# EAGLE design SparkFun_LilyPad_Tricolor-LED (EAGLE 9.1.0)
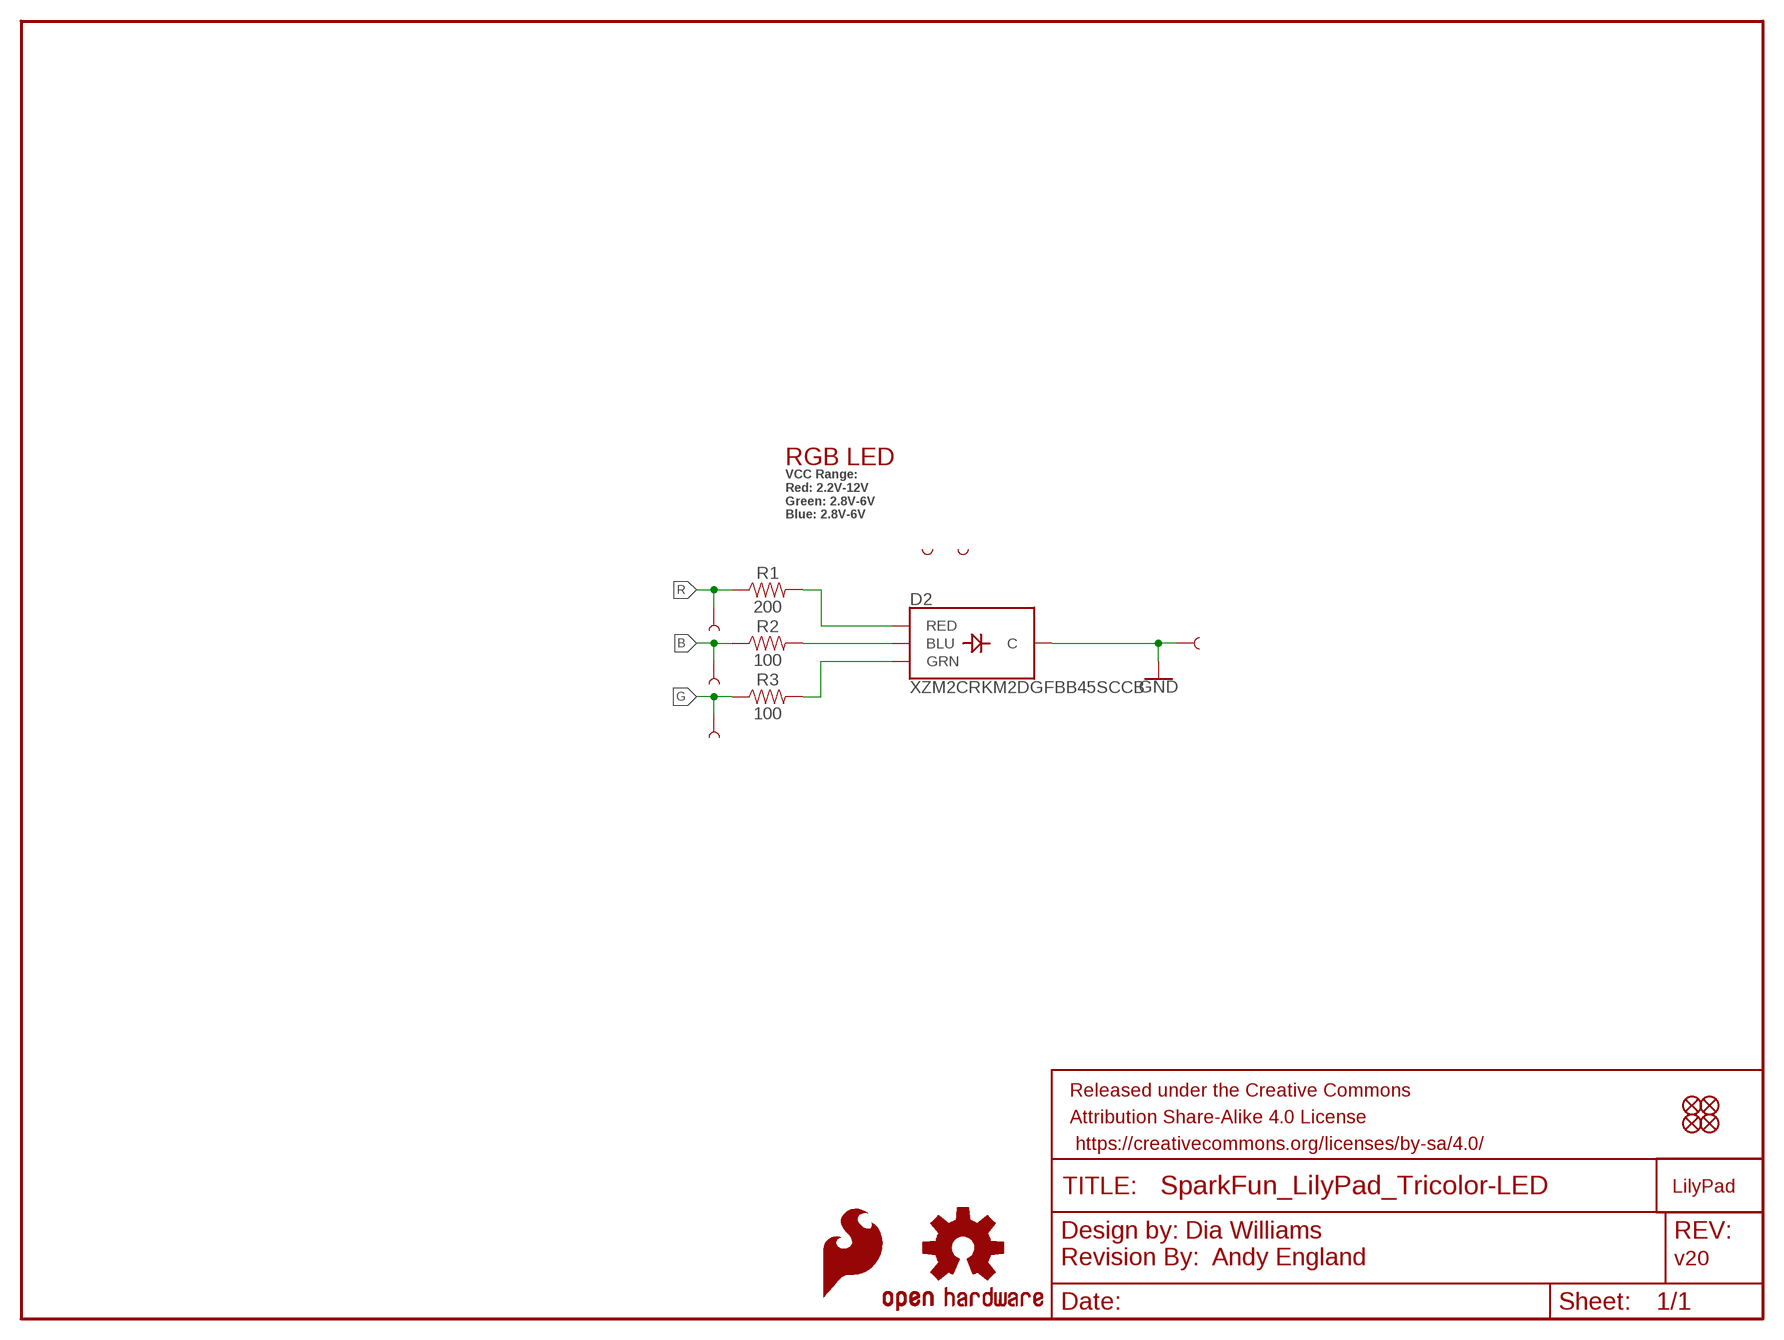
[diagram p0: schematic, sheet 1]

## Parts
D2  XZM2CRKM2DGFBB45SCCB  SUNLEDSMD1  [PLCC4SMDLED]
FD1  FIDUCIAL1X2  [FIDUCIAL-1X2]
FD2  FIDUCIAL1X2  [FIDUCIAL-1X2]
FD3  FIDUCIAL1X2  [FIDUCIAL-1X2]
FD4  FIDUCIAL1X2  [FIDUCIAL-1X2]
FRAME1  FRAME-LETTER  [CREATIVE_COMMONS]
LOGO1  REVISION  [REVISION]
LOGO2  OSHW-LOGOS  [OSHW-LOGO-S]
LOGO3  SFE_LOGO_FLAME.1_INCH  [SFE_LOGO_FLAME_.1]
R1  200  200OHM-0603-1/10W-1%  [0603]
R2  100  100OHM-0603-1/10W-1%  [0603]
R3  100  100OHM-0603-1/10W-1%  [0603]
U$1  LOGO-LPLP  [LOGO-LILYPAD]
U$2  SEWTAP-NOHOLE2  [PETAL-NOHOLE-2SIDE]
U$3  SEWTAP-NOHOLE2  [PETAL-NOHOLE-2SIDE]
U$7  SEWTAP6  [PETAL-SMALL-2SIDE]
U$8  SEWTAP6  [PETAL-SMALL-2SIDE]
U$9  SEWTAP6  [PETAL-SMALL-2SIDE]
U$10  SEWTAP6  [PETAL-SMALL-2SIDE]

## Nets
B: R2.1 U$9.1
BLU: D2.3(BLU) R2.2
G: R3.1 U$8.1
GND: D2.4(C) U$10.1
GRN: D2.2(GRN) R3.2
R: R1.1 U$7.1
RED: D2.1(RED) R1.2

## Notes on the sheet
- RGB LED
- VCC Range:
  Red: 2.2V-12V
  Green: 2.8V-6V
  Blue: 2.8V-6V
- Dia Williams
- Andy England | v20

## Library data of the parts
D2 = SparkFun-LED:SUNLED: LED-RGB Common Cathode XZM2CRKM2DGFBB45SCCB Packages: PLCC4 SparkFun Products: Lilypad Prototyping Board <[https://www.sparkfun.com/products/9264]>; PROD_ID: DIO-13722
FD1-FD4 = SparkFun-Aesthetics:FIDUCIAL: Fiducial Alignment Points Point-of-reference for pick-and-place machines and other optical instruments.
FRAME1 = SparkFun-Aesthetics:FRAME-LETTER: Schematic Frame - Letter Standard 8.5x11 US Letter frame
LOGO1 = SparkFun-Aesthetics:REVISION: "Revision By" Text Preceding text for revisor documentation. Includes schematic text on "symbols" layer, and board text on tDoc.
LOGO2 = SparkFun-Aesthetics:OSHW-LOGO: Open-Source Hardware (OSHW) Logo This logo indicates the piece of hardware it is found on incorporates a OSHW license and/or adheres to the definition of open source hardware found here: http://freedomdefined.org/OSHW
LOGO3 = SparkFun-Aesthetics:SFE_LOGO_FLAME: SparkFun Flame Logo This is the SparkFun flame logo. The logo on the schematic will always be the same size; the package variant is the height of the flame. Default layer for the logo on the board is tSilk.
R1 = SparkFun-Resistors:200OHM: 200Ω resistor A resistor is a passive two-terminal electrical component that implements electrical resistance as a circuit element. Resistors act to reduce current flow, and, at the same time, act to lower voltage levels within circuits. - Wikipedia; PROD_ID: RES-08220
R2 R3 = SparkFun-Resistors:100OHM: 100Ω resistor A resistor is a passive two-terminal electrical component that implements electrical resistance as a circuit element. Resistors act to reduce current flow, and, at the same time, act to lower voltage levels within circuits. - Wikipedia; PROD_ID: RES-07863
U$1 = SparkFun-Retired:LOGO-LP
U$2 U$3 = LilyPad-Wearables:SEWTAP-NOHOLE
U$7-U$10 = LilyPad-Wearables:SEWTAP

## Board
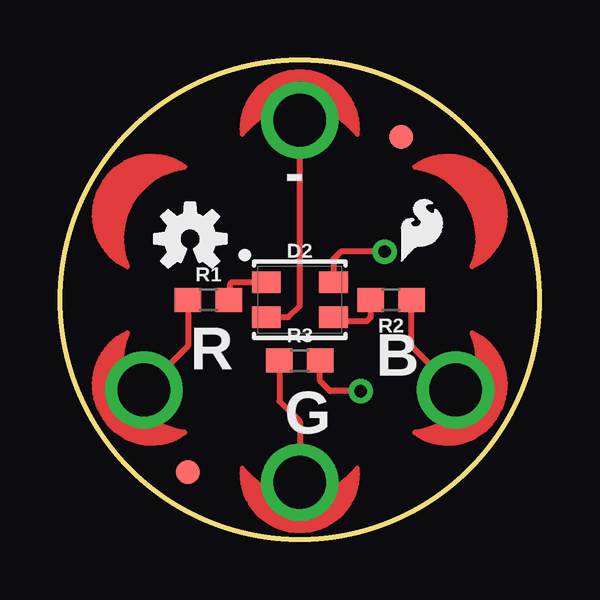
[diagram p1: board, top side]
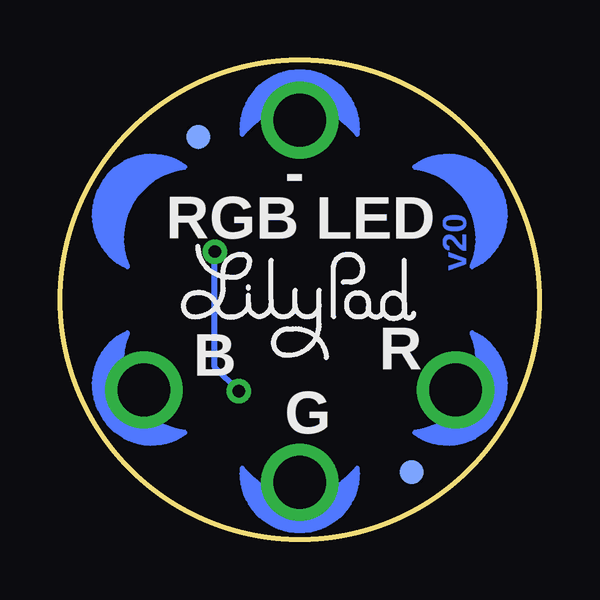
[diagram p2: board, bottom side, seen from below]

Size 20 x 20 mm. Coordinates in mm from the lower left corner, seen from the top.
Outline: circle at 10,10 radius 10
Copper layers (1*16): Top 0.035mm / dielectric 1.5mm / Bottom 0.035mm
Design rules "SparkFun-2-layer-STANDARD": minimum track width 10mil, minimum drill 20mil, track to track 10mil, track to pad 8mil, pad to pad 8mil, via to via 10mil, smd to smd 8mil, copper to edge 8mil, drill to drill 8mil, minimum pad ring 10mil, minimum via ring 10mil, stop-mask expansion 4mil, vias tented up to drill 25mil, thermal gap 10mil

### Footprints (pad centres in the part's own frame; a part is rotated, then mirrored left to right if it is on the bottom)
PLCC4SMDLED = smd 1.2 x 0.9: 1 -1.4,0.725; 2 1.4,0.725; 3 1.4,-0.725; 4 -1.4,-0.725
FIDUCIAL-1X2 = smd 1 x 1: 1 0,0
0603 = smd 1.1 x 1: 1 -0.85,0; 2 0.85,0
PETAL-SMALL-2SIDE = drill 2.2: 1 0,0

### Placement (x,y rotation side)
D2  10,10 0 top
FD1  5.34,2.81 0 top
FD2  5.34,2.81 0 bottom
FD3  14.23,16.78 0 top
FD4  14.23,16.78 0 bottom
FRAME1  -19.88,-12.43 0 top  (outside the outline)
LOGO1  -8.63,-14.97 0 top  (outside the outline)
LOGO2  5.43,12.54 0 top
LOGO3  13.94,11.27 0 top
R1  6.19,10 0 top
R2  13.81,10 180 top
R3  10,7.46 0 top
U$1  10,10.25 0 bottom
U$2  16.5,13.76 120 top
U$3  3.5,13.76 240 top
U$4  [ORDERING_INSTRUCTIONS]  -11.17,-16.24 0 top  (outside the outline)
U$7  3.5,6.24 300 top
U$8  10,2.38 0 top
U$9  16.5,6.24 60 top
U$10  10,17.49 180 top

### Tracks (layer width: path | path; a pad name or v marks a point on that pad's centre or on a via)
B
  Top 0.254: U$9.1 14.66,8.08 R2.1
BLU
  Top 0.254: D2.3 11.56,9.11 12.79,9.11 12.96,9.28 R2.2
G
  Top 0.254: R3.1 9.15,5.77 10,4.92 U$8.1
GND
  Top 0.254: D2.4 9.53,9.27 10,9.75 U$10.1
GRN  (via drill 0.51)
  Top 0.254: v13.54,12.01 11.71,12.01 11.4,11.69 D2.2 | v12.54,6.19 11.27,6.19 10.85,6.61 R3.2
  Bottom 0.254: v13.54,12.01 13.54,7.19 v12.54,6.19
R
  Top 0.254: R1.1 5.34,8.08 U$7.1
RED
  Top 0.254: D2.1 7.17,10.72 7.08,10.63 7.08,10.04 R1.2

### Text on the board
Bottom: v20
tPlace: - | R | B | G
bPlace: - | RGB LED | R | B | G
Measures: Units in MM
tDocu: Dia Williams | Andy England | Thin PCB - .8mm | LilyPad Purple Soldermask